# Altium schematic sheet INV.ControlMCU.SchDoc
size A0; SheetNumber: 3; SheetTotal: 3
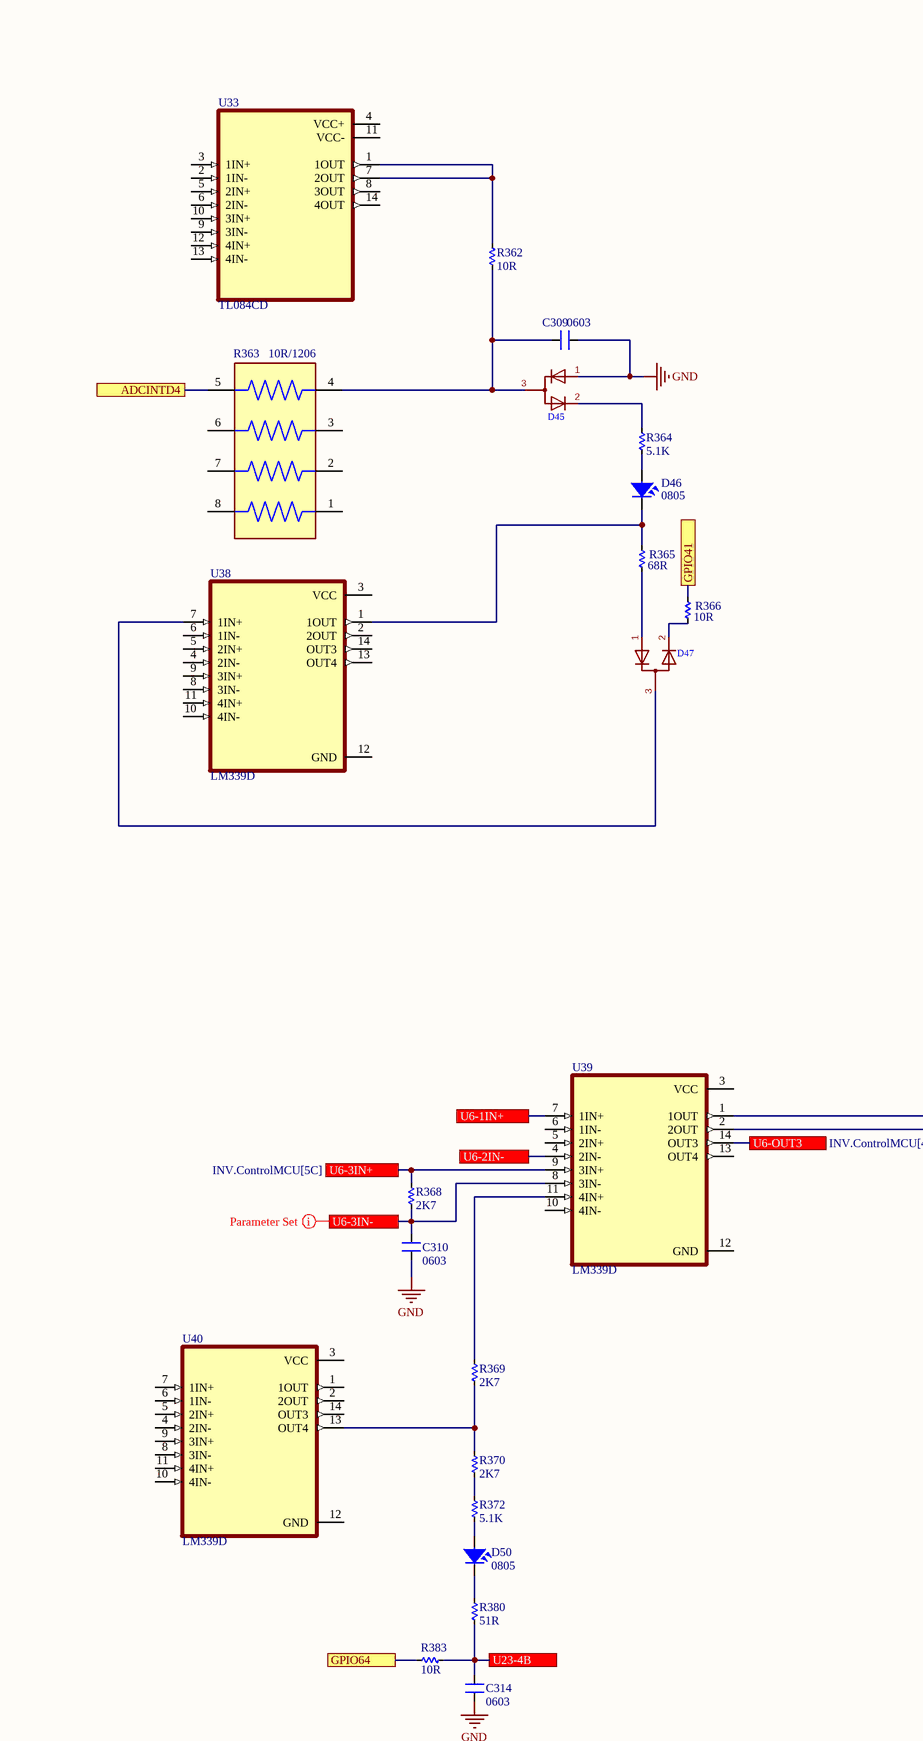
[diagram p0: INV.ControlMCU.SchDoc, top left]
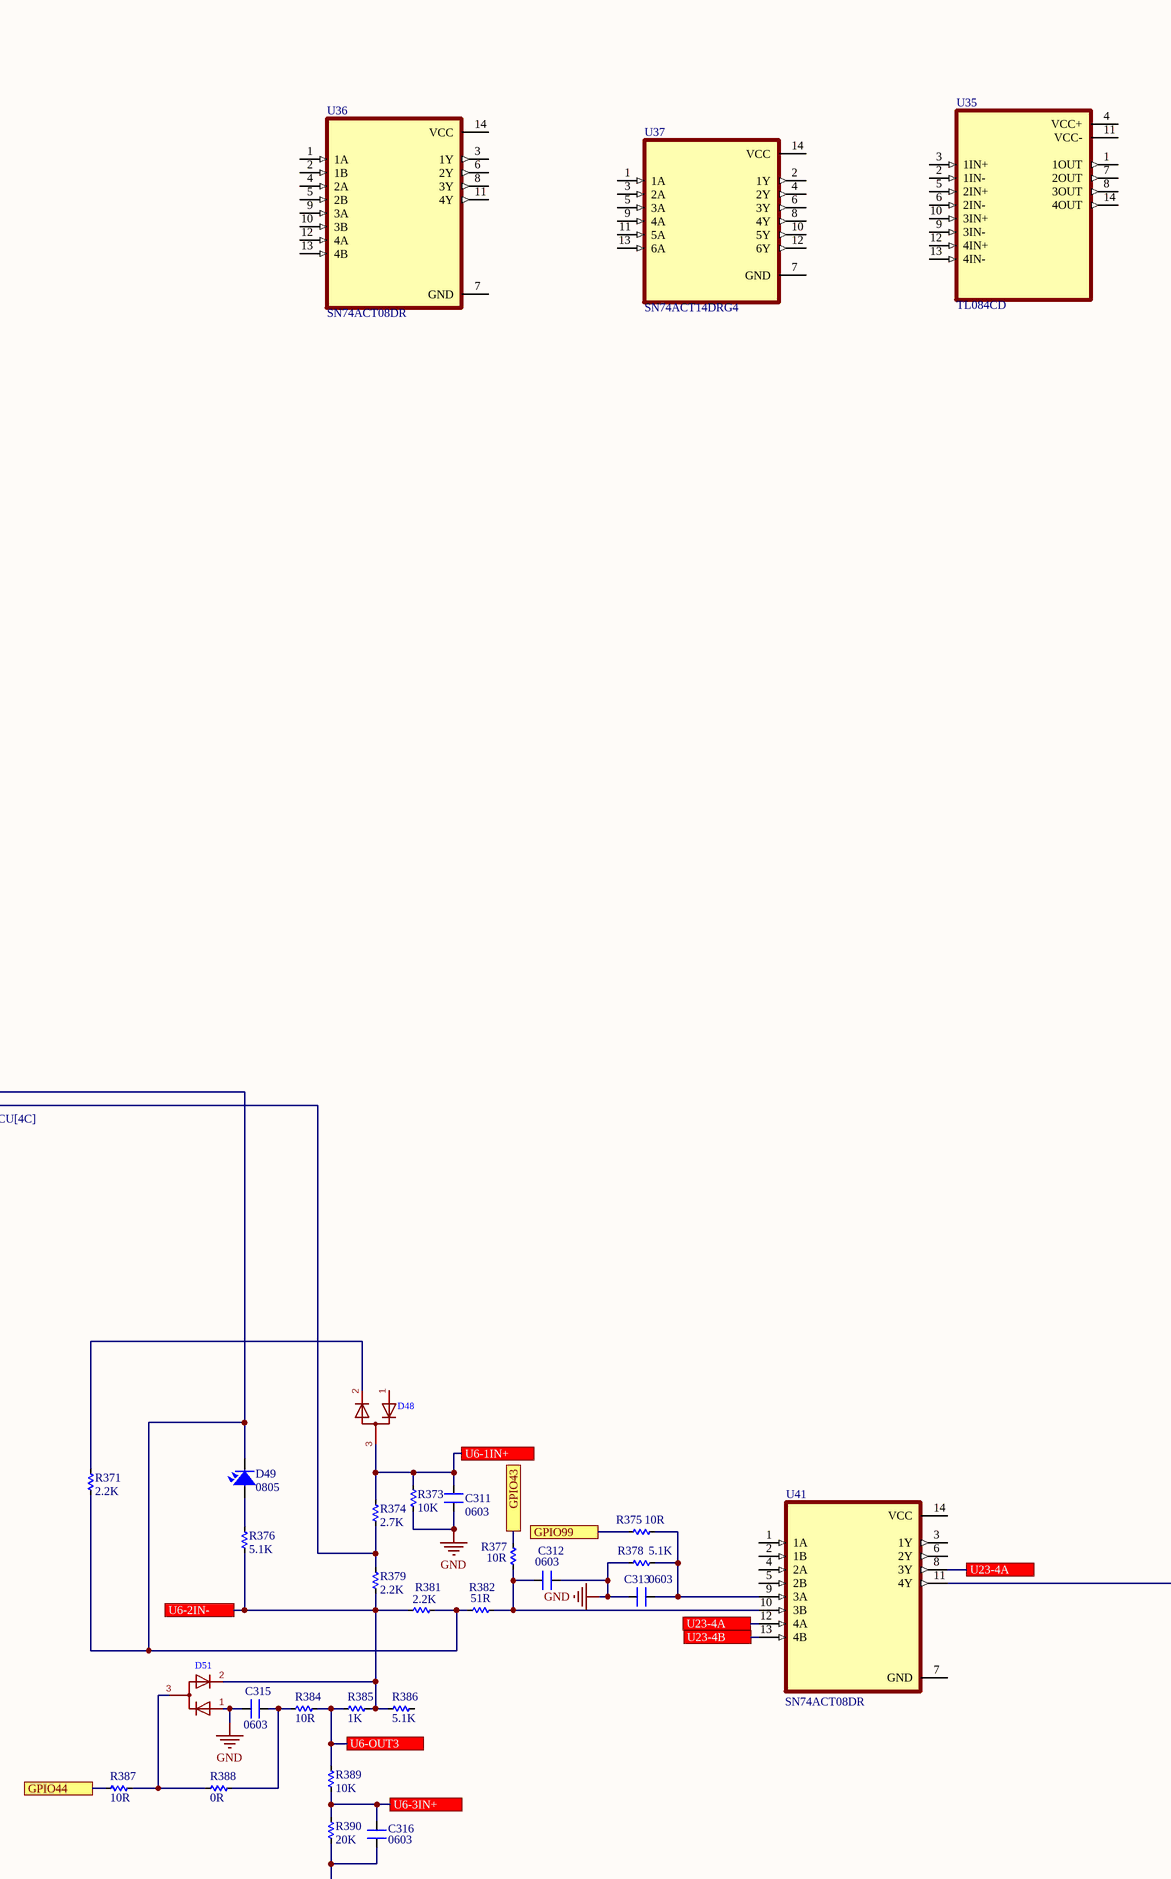
[diagram p1: INV.ControlMCU.SchDoc, top middle]
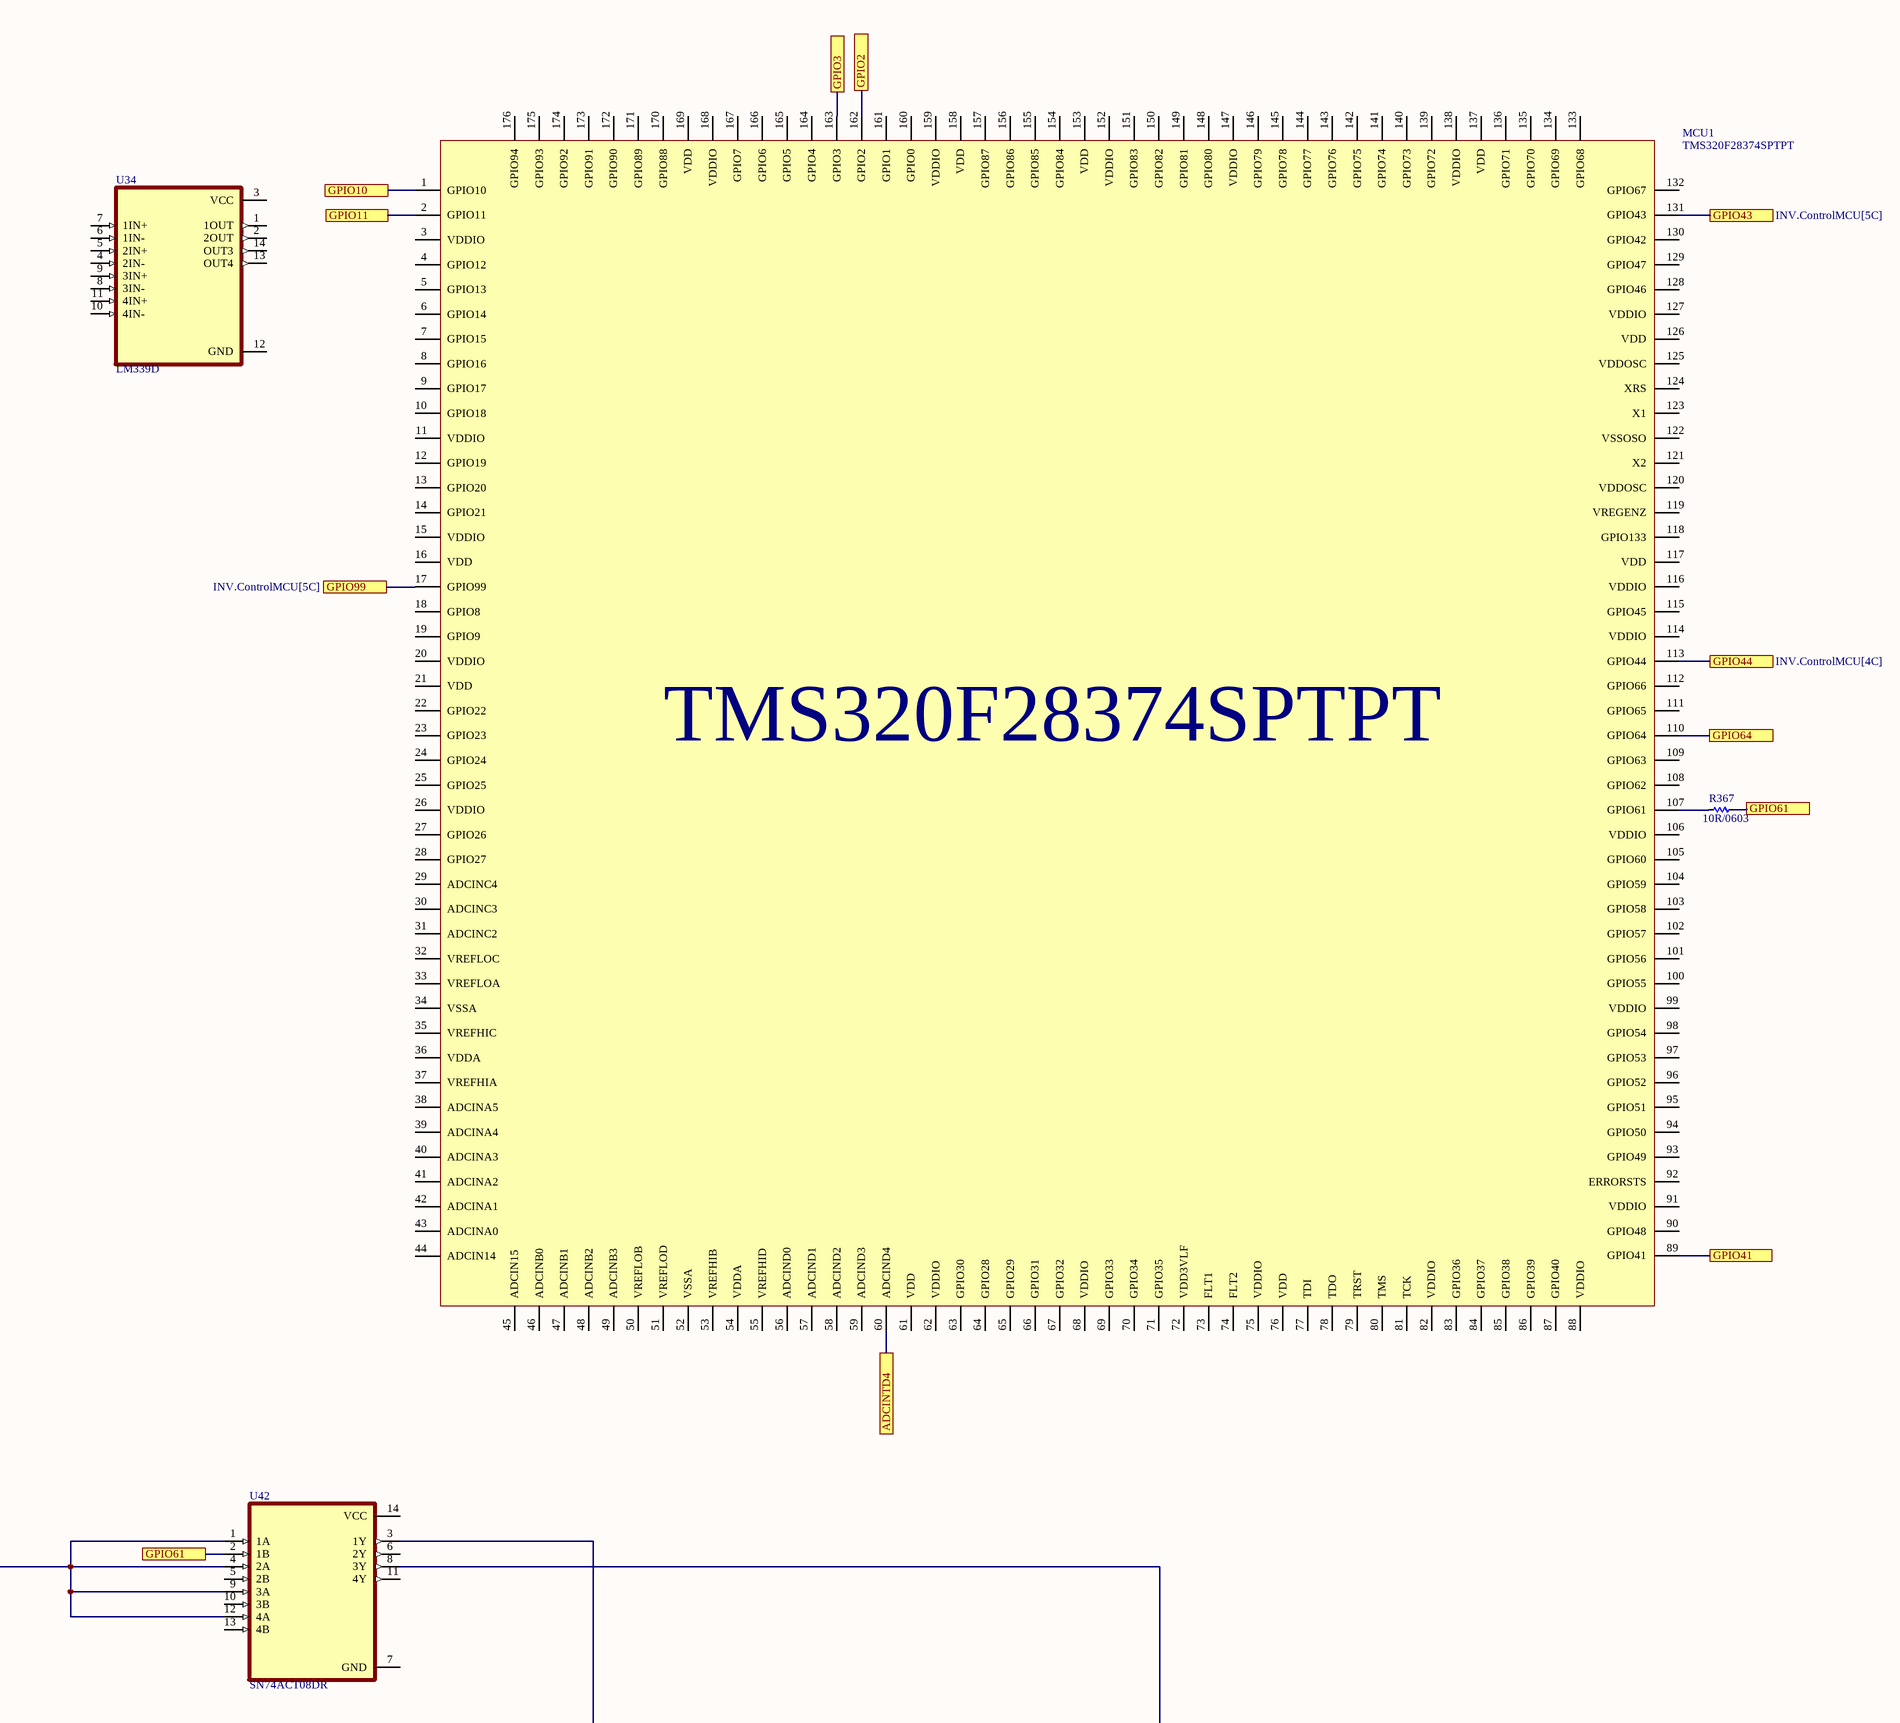
[diagram p2: INV.ControlMCU.SchDoc, top right]
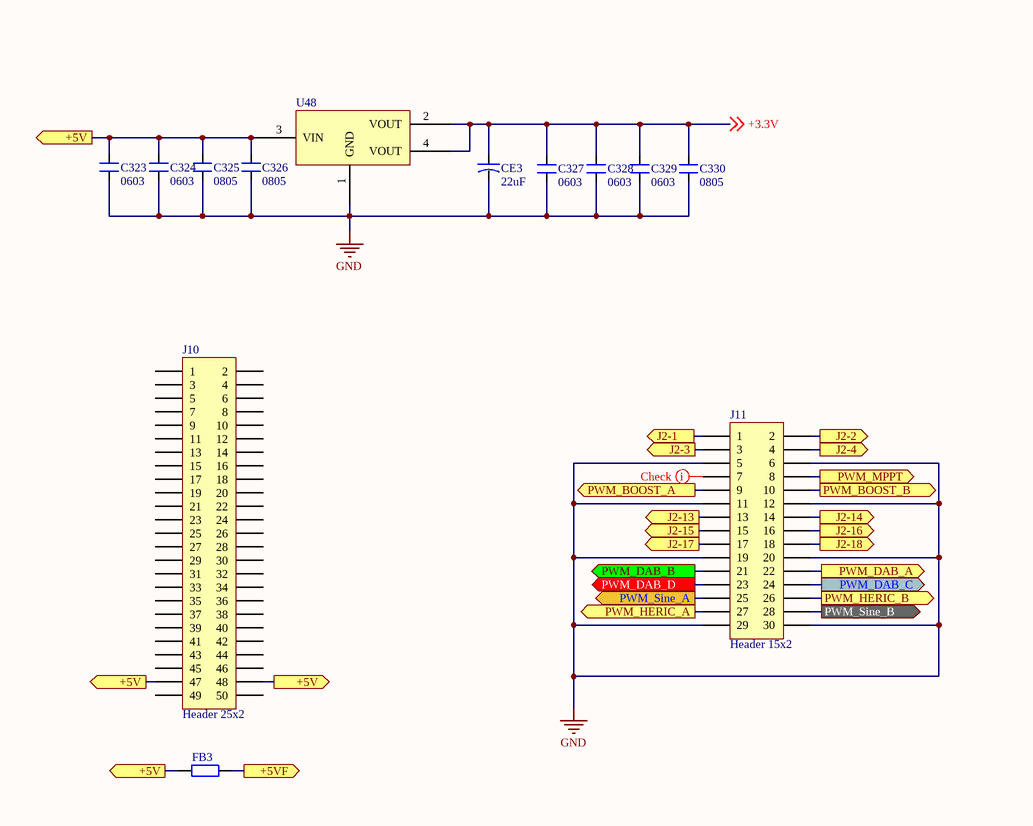
[diagram p3: INV.ControlMCU.SchDoc, bottom left]
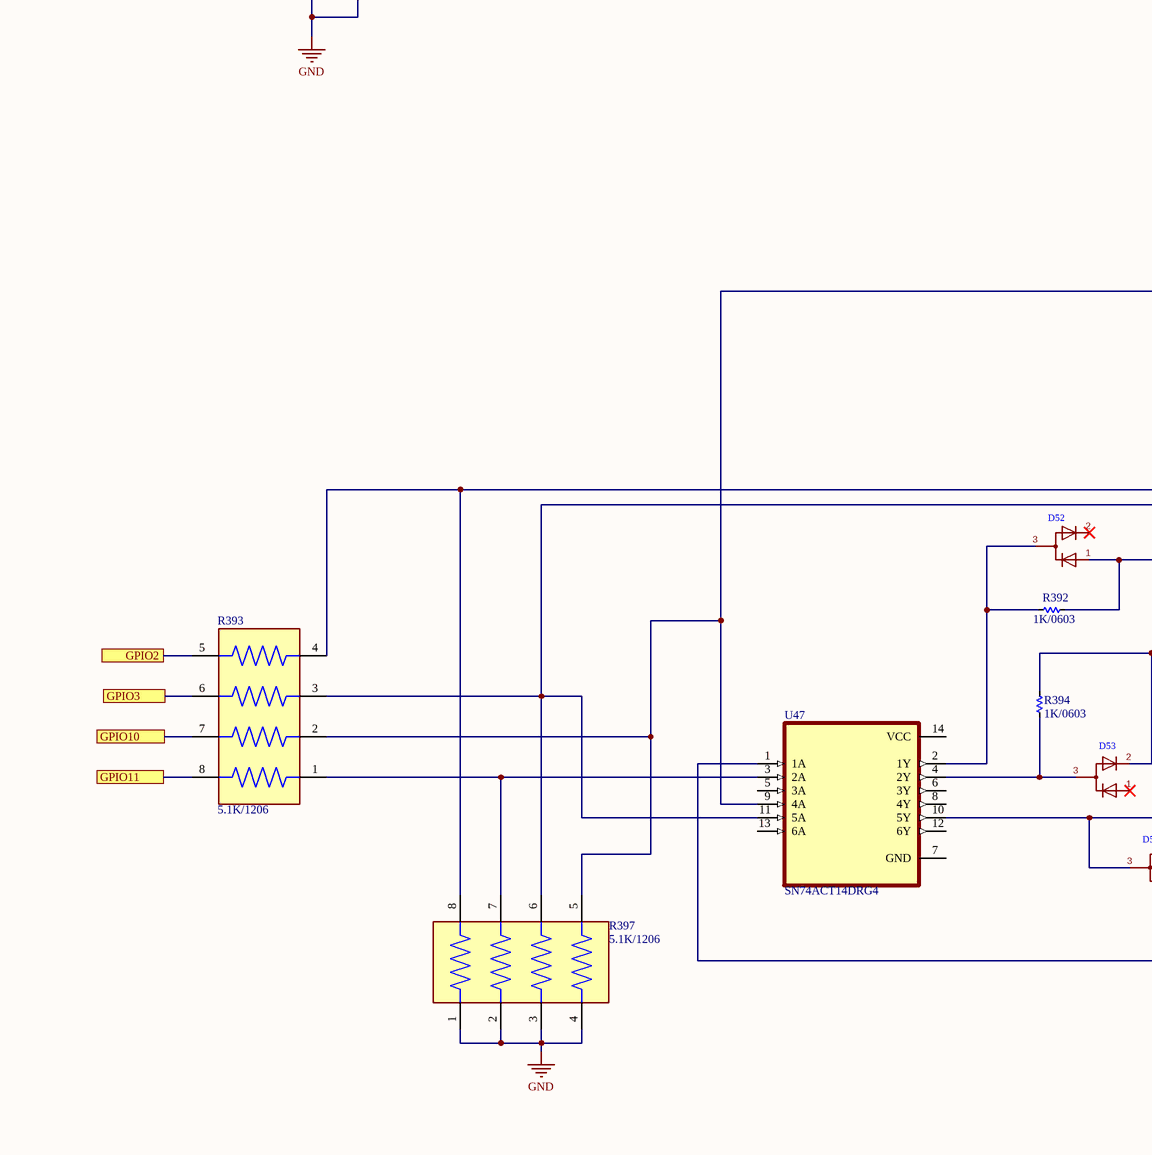
[diagram p4: INV.ControlMCU.SchDoc, bottom middle]
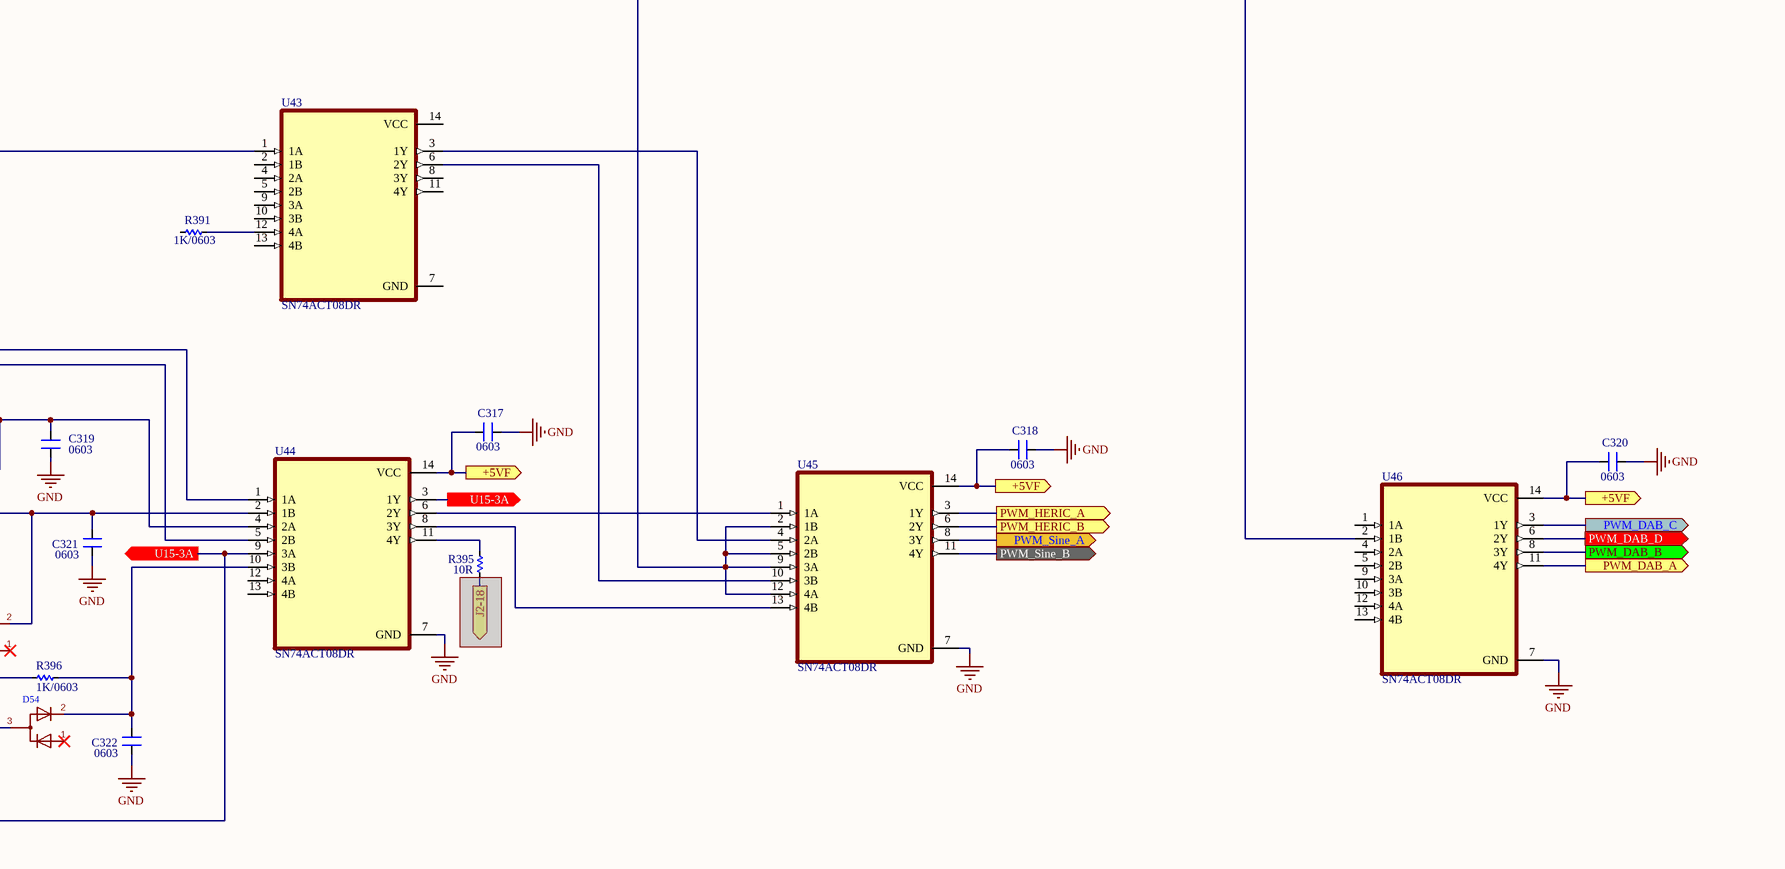
[diagram p5: INV.ControlMCU.SchDoc, bottom right]

## Parts
C309  0603  [CAP-SMD-0805 EX]
C310  0603  [CAP-SMD-0805 EX]
C311  0603  [CAP-SMD-0805 EX]
C312  0603  [CAP-SMD-0805 EX]
C313  0603  [CAP-SMD-0805 EX]
C314  0603  [CAP-SMD-0805 EX]
C315  0603  [CAP-SMD-0805 EX]
C316  0603  [CAP-SMD-0805 EX]
C317  0603  [CAP-SMD-0805 EX]
C318  0603  [CAP-SMD-0805 EX]
C319  0603  [CAP-SMD-0805 EX]
C320  0603  [CAP-SMD-0805 EX]
C321  0603  [CAP-SMD-0805 EX]
C322  0603  [CAP-SMD-0805 EX]
C323  0603  [CAP-SMD-0805 EX]
C324  0603  [CAP-SMD-0805 EX]
C325  0805  [CAP-SMD-0805 EX]
C326  0805  [CAP-SMD-0805 EX]
C327  0603  [CAP-SMD-0805 EX]
C328  0603  [CAP-SMD-0805 EX]
C329  0603  [CAP-SMD-0805 EX]
C330  0805  [CAP-SMD-0805 EX]
CE3  22uF  [CAP-ALU-SMD-4]
D45  Dual-Diode_CA_1  [SOT-23]  (value not drawn)
D46  0805  [LED 3512]
D47  Dual-Diode_CA_1  [SOT-23]  (value not drawn)
D48  Dual-Diode_CA_1  [SOT-23]  (value not drawn)
D49  0805  [LED 3512]
D50  0805  [LED 3512]
D51  Dual-Diode_CA_1  [SOT-23]  (value not drawn)
D52  Dual-Diode_CA_1  [SOT-23]  (value not drawn)
D53  Dual-Diode_CA_1  [SOT-23]  (value not drawn)
D54  Dual-Diode_CA_1  [SOT-23]  (value not drawn)
FB3  (no value)  [RESC-0603 (1608)]
J10  Header 25x2  [Head 1X16 - CAI THANG]
J11  Header 15x2  [Head 1X16 - CAI THANG]
MCU1  TMS320F28374SPTPT
R362  10R  [RES-SMD-0603 EX]
R363  10R/1206  [RESCAXS80P320X150X55-8N]
R364  5.1K  [RES-SMD-0603 EX]
R365  68R  [RES-SMD-0603 EX]
R366  10R  [RES-SMD-0603 EX]
R367  10R/0603  [RES-SMD-0603 EX]
R368  2K7  [RES-SMD-0603 EX]
R369  2K7  [RES-SMD-0603 EX]
R370  2K7  [RES-SMD-0603 EX]
R371  2.2K  [RES-SMD-0603 EX]
R372  5.1K  [RES-SMD-0603 EX]
R373  10K  [RES-SMD-0603 EX]
R374  2.7K  [RES-SMD-0603 EX]
R375  10R  [RES-SMD-0603 EX]
R376  5.1K  [RES-SMD-0603 EX]
R377  10R  [RES-SMD-0603 EX]
R378  5.1K  [RES-SMD-0603 EX]
R379  2.2K  [RES-SMD-0603 EX]
R380  51R  [RES-SMD-0603 EX]
R381  2.2K  [RES-SMD-0603 EX]
R382  51R  [RES-SMD-0603 EX]
R383  10R  [RES-SMD-0603 EX]
R384  10R  [RES-SMD-0603 EX]
R385  1K  [RES-SMD-0603 EX]
R386  5.1K  [RES-SMD-0603 EX]
R387  10R  [RES-SMD-0603 EX]
R388  0R  [RES-SMD-0603 EX]
R389  10K  [RES-SMD-0603 EX]
R390  20K  [RES-SMD-0603 EX]
R391  1K/0603  [RES-SMD-0603]
R392  1K/0603  [RES-SMD-0603]
R393  5.1K/1206  [RESCAXS80P320X150X55-8N]
R394  1K/0603  [RES-SMD-0603]
R395  10R  [RES-1/2W]
R396  1K/0603  [RES-SMD-0603]
R397  5.1K/1206  [RESCAXS80P320X150X55-8N]
U33  TL084CD  [SOIC127P600X175-14N]
U34  LM339D  [SOIC127P600X175-14N]
U35  TL084CD  [SOIC127P600X175-14N]
U36  SN74ACT08DR  [SOIC127P600X175-14N]
U37  SN74ACT14DRG4  [SOIC127P600X175-14N]
U38  LM339D  [SOIC127P600X175-14N]
U39  LM339D  [SOIC127P600X175-14N]
U40  LM339D  [SOIC127P600X175-14N]
U41  SN74ACT08DR  [SOIC127P600X175-14N]
U42  SN74ACT08DR  [SOIC127P600X175-14N]
U43  SN74ACT08DR  [SOIC127P600X175-14N]
U44  SN74ACT08DR  [SOIC127P600X175-14N]
U45  SN74ACT08DR  [SOIC127P600X175-14N]
U46  SN74ACT08DR  [SOIC127P600X175-14N]
U47  SN74ACT14DRG4  [SOIC127P600X175-14N]
U48  LM1117B  [SOT223]  (value not drawn)

## Ports
+5V (out, see INV.ControlMCU[1D], INV.Main[1D], INV.Main[3A], INV.Main[3D], INV.Main[4A], INV.Power[1D], INV.Power[6C]), +5VF (out, see INV.ControlMCU[1D], INV.ControlMCU[8C], INV.ControlMCU[9C], INV.Main[1D], INV.Main[3D]), +5VF (out, see INV.ControlMCU[1D], INV.ControlMCU[8C], INV.ControlMCU[11C], INV.Main[1D], INV.Main[3D]), +5VF (out, see INV.ControlMCU[1D], INV.ControlMCU[9C], INV.ControlMCU[11C], INV.Main[1D], INV.Main[3D]), +5VF (out, see INV.ControlMCU[8C], INV.ControlMCU[9C], INV.ControlMCU[11C], INV.Main[1D], INV.Main[3D]), ADCINTD4 (see INV.ControlMCU[1A]), ADCINTD4 (see INV.ControlMCU[9B]), GPIO2 (see INV.ControlMCU[4C]), GPIO2 (see INV.ControlMCU[9A]), GPIO3 (see INV.ControlMCU[4D]), GPIO3 (see INV.ControlMCU[9A]), GPIO10 (see INV.ControlMCU[4D]), GPIO10 (see INV.ControlMCU[7A]), GPIO11 (see INV.ControlMCU[4D]), GPIO11 (see INV.ControlMCU[7A]), GPIO41 (see INV.ControlMCU[3B]), GPIO41 (see INV.ControlMCU[11B]), GPIO43 (see INV.ControlMCU[5C]), GPIO43 (see INV.ControlMCU[11A]), GPIO44 (see INV.ControlMCU[4C]), GPIO44 (see INV.ControlMCU[11B]), GPIO61 (see INV.ControlMCU[7C]), GPIO61 (see INV.ControlMCU[11B]), GPIO64 (see INV.ControlMCU[2C]), GPIO64 (see INV.ControlMCU[11B]), GPIO99 (see INV.ControlMCU[5C]), GPIO99 (see INV.ControlMCU[7B]), J2-1 (out, see INV.Main[1D]), J2-2 (out, see INV.Main[1D]), J2-3 (out, see INV.Main[1D]), J2-4 (out, see INV.Main[1D]), J2-13 (out, see INV.Main[1D]), J2-14 (out, see INV.Main[1D]), J2-15 (out, see INV.Main[1D]), J2-16 (out, see INV.Main[1D]), J2-17 (out, see INV.Main[1D]), J2-18 (out, see INV.ControlMCU[3D], INV.Main[1D]), J2-18 (out, see INV.Main[1D]), PWM_BOOST_A (out, see INV.Main[1D], INV.Main[2B]), PWM_BOOST_B (out, see INV.Main[1D], INV.Main[3B]), PWM_DAB_A (out, see INV.ControlMCU[3D], INV.Main[1B], INV.Main[1D]), PWM_DAB_A (out, see INV.ControlMCU[11D], INV.Main[1B], INV.Main[1D]), PWM_DAB_B (out, see INV.ControlMCU[2D], INV.Main[1B], INV.Main[1D]), PWM_DAB_B (out, see INV.ControlMCU[11C], INV.Main[1B], INV.Main[1D]), PWM_DAB_C (out, see INV.ControlMCU[3D], INV.Main[1D], INV.Main[2B]), PWM_DAB_C (out, see INV.ControlMCU[11C], INV.Main[1D], INV.Main[2B]), PWM_DAB_D (out, see INV.ControlMCU[2D], INV.Main[1D], INV.Main[2B]), PWM_DAB_D (out, see INV.ControlMCU[11C], INV.Main[1D], INV.Main[2B]), PWM_HERIC_A (out, see INV.ControlMCU[2D], INV.Main[1D], INV.Main[4B]), PWM_HERIC_A (out, see INV.ControlMCU[9C], INV.Main[1D], INV.Main[4B]), PWM_HERIC_B (out, see INV.ControlMCU[3D], INV.Main[1D], INV.Main[4B]), PWM_HERIC_B (out, see INV.ControlMCU[9C], INV.Main[1D], INV.Main[4B]), PWM_MPPT (out, see INV.Main[1D], INV.Main[4D]), PWM_Sine_A (out, see INV.ControlMCU[2D], INV.Main[1D], INV.Main[3B]), PWM_Sine_A (out, see INV.ControlMCU[9C], INV.Main[1D], INV.Main[3B]), PWM_Sine_B (out, see INV.ControlMCU[3D], INV.Main[1D], INV.Main[3B]), PWM_Sine_B (out, see INV.ControlMCU[9D], INV.Main[1D], INV.Main[3B]), U6-1IN+ (see INV.ControlMCU[2B]), U6-1IN+ (see INV.ControlMCU[5B]), U6-2IN- (see INV.ControlMCU[2B]), U6-2IN- (see INV.ControlMCU[4C]), U6-3IN+ (see INV.ControlMCU[2B]), U6-3IN+ (see INV.ControlMCU[5C]), U6-3IN-, U6-OUT3 (see INV.ControlMCU[3B]), U6-OUT3 (see INV.ControlMCU[4C]), U15-3A (out, see INV.ControlMCU[7D]), U15-3A (out, see INV.ControlMCU[8C]), U23-4A (see INV.ControlMCU[5C]), U23-4A (see INV.ControlMCU[6C]), U23-4B (see INV.ControlMCU[2C]), U23-4B (see INV.ControlMCU[5C])

## Nets
GND: C309.1 C310.1 C311.2 C312.1 C313.2 C314.1 C315.2 C316.2 C317.1 C318.1 C319.1 C320.1 C321.1 C322.1 C323.1 C324.1 C325.1 C326.1 C327.1 C328.1 C329.1 C330.1 CE3.2 D45.1(C) D51.1(C) J11.5 J11.6 J11.11 J11.12 J11.19 J11.20 J11.29 J11.30 R373.1 R378.2 R390.1 R397.1 R397.2 R397.3 R397.4 U44.7(GND) U45.7(GND) U46.7(GND) U48.1(GND)
+3.3V: C327.2 C328.2 C329.2 C330.2 CE3.1 U48.2(VOUT) U48.4(VOUT) ; off-sheet +3.3V
+5V: C323.2 C324.2 C325.2 C326.2 FB3.1 J10.47 J10.48 U48.3(VIN) ; port +5V
+5VF: C317.2 C318.2 C320.2 FB3.2 U44.14(VCC) U45.14(VCC) U46.14(VCC) ; port +5VF
ADCINTD4: MCU1.60(ADCIND4) R363.5 ; port ADCINTD4
GPIO2: MCU1.162(GPIO2) R393.5 ; port GPIO2
GPIO3: MCU1.163(GPIO3) R393.6 ; port GPIO3
GPIO10: MCU1.1(GPIO10) R393.7 ; port GPIO10
GPIO11: MCU1.2(GPIO11) R393.8 ; port GPIO11
GPIO41: MCU1.89(GPIO41) R366.1 ; port GPIO41
GPIO43: MCU1.131(GPIO43) R377.2 ; port GPIO43
GPIO44: MCU1.113(GPIO44) R387.1 ; port GPIO44
GPIO61: R367.1 U42.2(1B) ; port GPIO61
GPIO64: MCU1.110(GPIO64) R383.2 ; port GPIO64
GPIO99: MCU1.17(GPIO99) R375.2 ; port GPIO99
J2-1: J11.1 ; port J2-1
J2-2: J11.2 ; port J2-2
J2-3: J11.3 ; port J2-3
J2-4: J11.4 ; port J2-4
J2-13: J11.13 ; port J2-13
J2-14: J11.14 ; port J2-14
J2-15: J11.15 ; port J2-15
J2-16: J11.16 ; port J2-16
J2-17: J11.17 ; port J2-17
J2-18: J11.18 ; port J2-18
PWM_BOOST_A: J11.9 ; port PWM_BOOST_A
PWM_BOOST_B: J11.10 ; port PWM_BOOST_B
PWM_DAB_A: J11.22 U46.11(4Y) ; port PWM_DAB_A
PWM_DAB_B: J11.21 U46.8(3Y) ; port PWM_DAB_B
PWM_DAB_C: J11.24 U46.3(1Y) ; port PWM_DAB_C
PWM_DAB_D: J11.23 U46.6(2Y) ; port PWM_DAB_D
PWM_HERIC_A: J11.27 U45.3(1Y) ; port PWM_HERIC_A
PWM_HERIC_B: J11.26 U45.6(2Y) ; port PWM_HERIC_B
PWM_MPPT: J11.8 ; port PWM_MPPT
PWM_Sine_A: J11.25 U45.8(3Y) ; port PWM_Sine_A
PWM_Sine_B: J11.28 U45.11(4Y) ; port PWM_Sine_B
U6-1IN+: C311.1 D48.3(A) R373.2 R374.1 U39.7(1IN+) ; port U6-1IN+
U6-2IN-: D51.2(C) R376.1 R379.2 R381.2 R385.2 R386.2 U39.4(2IN-) ; port U6-2IN-
U6-3IN+: C316.1 R368.2 R389.1 R390.2 U39.9(3IN+) ; port U6-3IN+
U6-3IN-: C310.2 R368.1 U39.8(3IN-) ; port U6-3IN-
U6-OUT3: R384.2 R385.1 R389.2 U39.14(OUT3) ; port U6-OUT3
U15-3A: U44.3(1Y) U44.9(3A) U47.1(1A) ; port U15-3A
U23-4A: U41.8(3Y) U41.12(4A) ; port U23-4A
U23-4B: C314.2 R380.1 R383.1 U41.13(4B) ; port U23-4B
NetC309_2: C309.2 D45.3(A) R362.1 R363.4
NetC312_2: C312.2 R377.1 R382.1 U41.10(3B)
NetC313_1: C313.1 R375.1 R378.1 U41.9(3A)
NetC315_1: C315.1 R384.1 R388.2
NetC319_2: C319.2 D52.1(C) R392.2 U44.4(2A)
NetC321_2: C321.2 D53.2(C) R394.1 U44.2(1B)
NetC322_2: C322.2 D54.2(C) R396.2 U44.10(3B)
NetD45_2: D45.2(C) R364.1
NetD46_1: D46.1 R364.2
NetD46_2: D46.2 R365.1 U38.1(1OUT)
NetD47_1: D47.1(C) R365.2
NetD47_2: D47.2(C) R366.2
NetD47_3: D47.3(A) U38.7(1IN+)
NetD48_2: D48.2(C) R371.2
NetD49_1: D49.1 R376.2
NetD49_2: D49.2 R371.1 R381.1 R382.2 U39.1(1OUT)
NetD50_1: D50.1 R372.2
NetD50_2: D50.2 R380.2
NetD51_3: D51.3(A) R387.2 R388.1
NetD52_3: D52.3(A) R392.1 U47.2(1Y)
NetD53_3: D53.3(A) R394.2 U47.4(2Y)
NetD54_3: D54.3(A) R396.1 U47.10(5Y)
NetMCU1_107: MCU1.107(GPIO61) R367.2
NetR362_2: R362.2 U33.1(1OUT) U33.7(2OUT)
NetR369_1: R369.1 R370.1 U40.13(OUT4)
NetR369_2: R369.2 U39.11(4IN+)
NetR370_2: R370.2 R372.1
NetR374_2: R374.2 R379.1 U39.2(2OUT)
NetR391_2: R391.2 U43.12(4A)
NetR393_1: R393.1 R397.7 U47.3(2A)
NetR393_2: R393.2 R397.5 U43.1(1A) U47.9(4A)
NetR393_3: R393.3 R397.6 U44.5(2B) U47.11(5A)
NetR393_4: R393.4 R397.8 U44.1(1A)
NetR395_1: R395.1 U44.11(4Y)
NetU41_11: U41.11(4Y) U42.1(1A) U42.4(2A) U42.9(3A) U42.12(4A)
NetU42_3: U42.3(1Y) U45.2(1B) U45.5(2B) U45.9(3A) U45.12(4A)
NetU42_8: U42.8(3Y) U46.2(1B)
NetU43_3: U43.3(1Y) U45.4(2A)
NetU43_6: U43.6(2Y) U45.10(3B)
NetU44_6: U44.6(2Y) U45.1(1A)
NetU44_8: U44.8(3Y) U45.13(4B)

Not connected (* = marked no-connect by the designer): D48 1(C); D52 2(C)*; D53 1(C)*; D54 1(C)*; J10 1 2 3 4 5 6 7 8 9 10 11 12 13 14 15 16 17 18 19 20 21 22 23 24 25 26 27 28 29 30 31 32 33 34 35 36 37 38 39 40 41 42 43 44 45 46 49 50; J11 7; MCU1 3(VDDIO) 4(GPIO12) 5(GPIO13) 6(GPIO14) 7(GPIO15) 8(GPIO16) 9(GPIO17) 10(GPIO18) 11(VDDIO) 12(GPIO19) 13(GPIO20) 14(GPIO21) 15(VDDIO) 16(VDD) 18(GPIO8) 19(GPIO9) 20(VDDIO) 21(VDD) 22(GPIO22) 23(GPIO23) 24(GPIO24) 25(GPIO25) 26(VDDIO) 27(GPIO26) 28(GPIO27) 29(ADCINC4) 30(ADCINC3) 31(ADCINC2) 32(VREFLOC) 33(VREFLOA) 34(VSSA) 35(VREFHIC) 36(VDDA) 37(VREFHIA) 38(ADCINA5) 39(ADCINA4) 40(ADCINA3) 41(ADCINA2) 42(ADCINA1) 43(ADCINA0) 44(ADCIN14) 45(ADCIN15) 46(ADCINB0) 47(ADCINB1) 48(ADCINB2) 49(ADCINB3) 50(VREFLOB) 51(VREFLOD) 52(VSSA) 53(VREFHIB) 54(VDDA) 55(VREFHID) 56(ADCIND0) 57(ADCIND1) 58(ADCIND2) 59(ADCIND3) 61(VDD) 62(VDDIO) 63(GPIO30) 64(GPIO28) 65(GPIO29) 66(GPIO31) 67(GPIO32) 68(VDDIO) 69(GPIO33) 70(GPIO34) 71(GPIO35) 72(VDD3VLF) 73(FLT1) 74(FLT2) 75(VDDIO) 76(VDD) 77(TDI) 78(TDO) 79(TRST) 80(TMS) 81(TCK) 82(VDDIO) 83(GPIO36) 84(GPIO37) 85(GPIO38) 86(GPIO39) 87(GPIO40) 88(VDDIO) 90(GPIO48) 91(VDDIO) 92(ERRORSTS) 93(GPIO49) 94(GPIO50) 95(GPIO51) 96(GPIO52) 97(GPIO53) 98(GPIO54) 99(VDDIO) 100(GPIO55) 101(GPIO56) 102(GPIO57) 103(GPIO58) 104(GPIO59) 105(GPIO60) 106(VDDIO) 108(GPIO62) 109(GPIO63) 111(GPIO65) 112(GPIO66) 114(VDDIO) 115(GPIO45) 116(VDDIO) 117(VDD) 118(GPIO133) 119(VREGENZ) 120(VDDOSC) 121(X2) 122(VSSOSO) 123(X1) 124(XRS) 125(VDDOSC) 126(VDD) 127(VDDIO) 128(GPIO46) 129(GPIO47) 130(GPIO42) 132(GPIO67) 133(GPIO68) 134(GPIO69) 135(GPIO70) 136(GPIO71) 137(VDD) 138(VDDIO) 139(GPIO72) 140(GPIO73) 141(GPIO74) 142(GPIO75) 143(GPIO76) 144(GPIO77) 145(GPIO78) 146(GPIO79) 147(VDDIO) 148(GPIO80) 149(GPIO81) 150(GPIO82) 151(GPIO83) 152(VDDIO) 153(VDD) 154(GPIO84) 155(GPIO85) 156(GPIO86) 157(GPIO87) 158(VDD) 159(VDDIO) 160(GPIO0) 161(GPIO1) 164(GPIO4) 165(GPIO5) 166(GPIO6) 167(GPIO7) 168(VDDIO) 169(VDD) 170(GPIO88) 171(GPIO89) 172(GPIO90) 173(GPIO91) 174(GPIO92) 175(GPIO93) 176(GPIO94); R363 1 2 3 6 7 8; R386 1; R391 1; R395 2; U33 2(1IN-) 3(1IN+) 4(VCC+) 5(2IN+) 6(2IN-) 8(3OUT) 9(3IN-) 10(3IN+) 11(VCC-) 12(4IN+) 13(4IN-) 14(4OUT); U34 1(1OUT) 2(2OUT) 3(VCC) 4(2IN-) 5(2IN+) 6(1IN-) 7(1IN+) 8(3IN-) 9(3IN+) 10(4IN-) 11(4IN+) 12(GND) 13(OUT4) 14(OUT3); U35 1(1OUT) 2(1IN-) 3(1IN+) 4(VCC+) 5(2IN+) 6(2IN-) 7(2OUT) 8(3OUT) 9(3IN-) 10(3IN+) 11(VCC-) 12(4IN+) 13(4IN-) 14(4OUT); U36 1(1A) 2(1B) 3(1Y) 4(2A) 5(2B) 6(2Y) 7(GND) 8(3Y) 9(3A) 10(3B) 11(4Y) 12(4A) 13(4B) 14(VCC); U37 1(1A) 2(1Y) 3(2A) 4(2Y) 5(3A) 6(3Y) 7(GND) 8(4Y) 9(4A) 10(5Y) 11(5A) 12(6Y) 13(6A) 14(VCC); U38 2(2OUT) 3(VCC) 4(2IN-) 5(2IN+) 6(1IN-) 8(3IN-) 9(3IN+) 10(4IN-) 11(4IN+) 12(GND) 13(OUT4) 14(OUT3); U39 3(VCC) 5(2IN+) 6(1IN-) 10(4IN-) 12(GND) 13(OUT4); U40 1(1OUT) 2(2OUT) 3(VCC) 4(2IN-) 5(2IN+) 6(1IN-) 7(1IN+) 8(3IN-) 9(3IN+) 10(4IN-) 11(4IN+) 12(GND) 14(OUT3); U41 1(1A) 2(1B) 3(1Y) 4(2A) 5(2B) 6(2Y) 7(GND) 14(VCC); U42 5(2B) 6(2Y) 7(GND) 10(3B) 11(4Y) 13(4B) 14(VCC); U43 2(1B) 4(2A) 5(2B) 7(GND) 8(3Y) 9(3A) 10(3B) 11(4Y) 13(4B) 14(VCC); U44 12(4A) 13(4B); U46 1(1A) 4(2A) 5(2B) 9(3A) 10(3B) 12(4A) 13(4B); U47 5(3A) 6(3Y) 7(GND) 8(4Y) 12(6Y) 13(6A) 14(VCC)

## Layout directives
mark named Check: NetJ11_7

## Library data of the parts
C309-C330 = CAP-SMD: Value: 33pF
CE3 = CAP-ALU-SMD: Published: 8-Jun-2000; LatestRevisionDate: 17-Jul-2002; LatestRevisionNote: Re-released for DXP Platform.; PackageReference: POLAR0.8; Publisher: Altium Limited
D45 D47 D48 D51-D54 = Dual-Diode_CA_1: BAT54S thay the BAV99:A7; ki_keywords: Dual Diode Common Anode; Value: Dual_Diode_CA; Reference: D; ki_description: Dual Diode Common Anode
D46 D49 D50 = LED1-SMD: Value: LED 3 - 5 ly 2 Colour
FB3 = RC0603FR-0775RL: RES SMD 75 OHM 1% 1/10W 0603; Solder: SMT; Value: 75R; MPN: RC0603FR-0775RL; Category: RESISTOR; PinCount: 2
J10 = Header 25x2: Header, 25x2-Pin 2.5mm; LatestRevisionDate: 17-Jul-2002; LatestRevisionNote: Re-released for DXP Platform.; Publisher: Altium Limited
J11 = Header 15x2: Header, 15x2-Pin 2.5mm; LatestRevisionDate: 17-Jul-2002; LatestRevisionNote: Re-released for DXP Platform.; Publisher: Altium Limited
R362 R364-R372 R374-R392 R394 R396 = Res-SMD: Resistor; Manufacturer: Generic Components; Class: Passive; Published: 08/06/2000; Publisher: Altium Hobart Technology Centre
R363 R393 R397 = Network Resistor: MF: {'manufacturer': u'Vishay Beyschlag'}; MP: ACASA1002S1002P1AT; Package: None; Price: None; Value: *; Availability: Unavailable
R373 = Res-SMD: 0603; Manufacturer: Generic Components; Class: Passive; Published: 08/06/2000; Publisher: Altium Hobart Technology Centre
R395 = Res: Manufacturer: Generic Components; Class: Passive; SubClass: R; Published: 08/06/2000; Publisher: Altium Hobart Technology Centre
U33 U35 = TL084CD: Quad High Slew Rate JFET-Input Operational Amplifier 14-SOIC 0 to 70; MF: Texas Instruments; DigiKey-Purchase-URL: https://snapeda.com/shop?store=DigiKey&id=139348; Package: SOIC-14 Texas Instruments; Mouser-Purchase-URL: https://snapeda.com/shop?store=Mouser&id=139348; MP: TL084CD; Value: *; SnapEDA_Link: https://www.snapeda.com/parts/TL084CD/Texas%20Instruments/view-part/139348/?ref=snap; Digi-Key_Part_Number: 296-1285-2-ND; BuyPart: https://www.snapeda.com/parts/TL084CD/Texas%20Instruments/view-part/139348/?ref=eda
U36 U41-U46 = SN74ACT08DR: Quadruple 2-Input Positive-AND Gates 14-SOIC -40 to 85; MF: Texas Instruments; Mouser-Purchase-URL: https://snapeda.com/shop?store=Mouser&id=433506; Package: SOIC-14 Texas Instruments; Texas_Instruments-Purchase-URL: https://snapeda.com/shop?store=Texas+Instruments&id=433506; Digi-Key_Part_Number: 296-1066-1-ND; Value: *; SnapEDA_Link: https://www.snapeda.com/parts/SN74ACT08DR/Texas%20Instruments/view-part/433506/?ref=snap; DigiKey-Purchase-URL: https://snapeda.com/shop?store=DigiKey&id=433506; MP: SN74ACT08DR; Arrow_Electronics-Purchase-URL: https://snapeda.com/shop?store=Arrow+Electronics&id=433506; Check_prices: https://www.snapeda.com/parts/SN74ACT08DR/Texas%20Instruments/view-part/433506/?ref=eda
U37 U47 = SN74ACT14DRG4: Hex Schmitt-Trigger Inverters 14-SOIC -40 to 85; MF: Texas Instruments; SnapEDA_Link: https://www.snapeda.com/parts/SN74ACT14DRG4/Texas+Instruments/view-part/?ref=snap; Package: SOIC-14 Texas Instruments; Value: *; MP: SN74ACT14DRG4; Check_prices: https://www.snapeda.com/parts/SN74ACT14DRG4/Texas+Instruments/view-part/?ref=eda
U48 = AMS1117 SMD: Dán; Value: AMS1117-3.3V SOT223; Don_Vi: Con; Ma_Hang: MH000596; Ghi_Chu: *; Kieu_Chan: *; Chung_Loai: Dán
U34 U38-U40 = LM339D: Price: None; Value: *; Package: None; Availability: Unavailable; MP: LM339D